# Altium schematic sheet CPU_IO_Ports.SchDoc
size A4
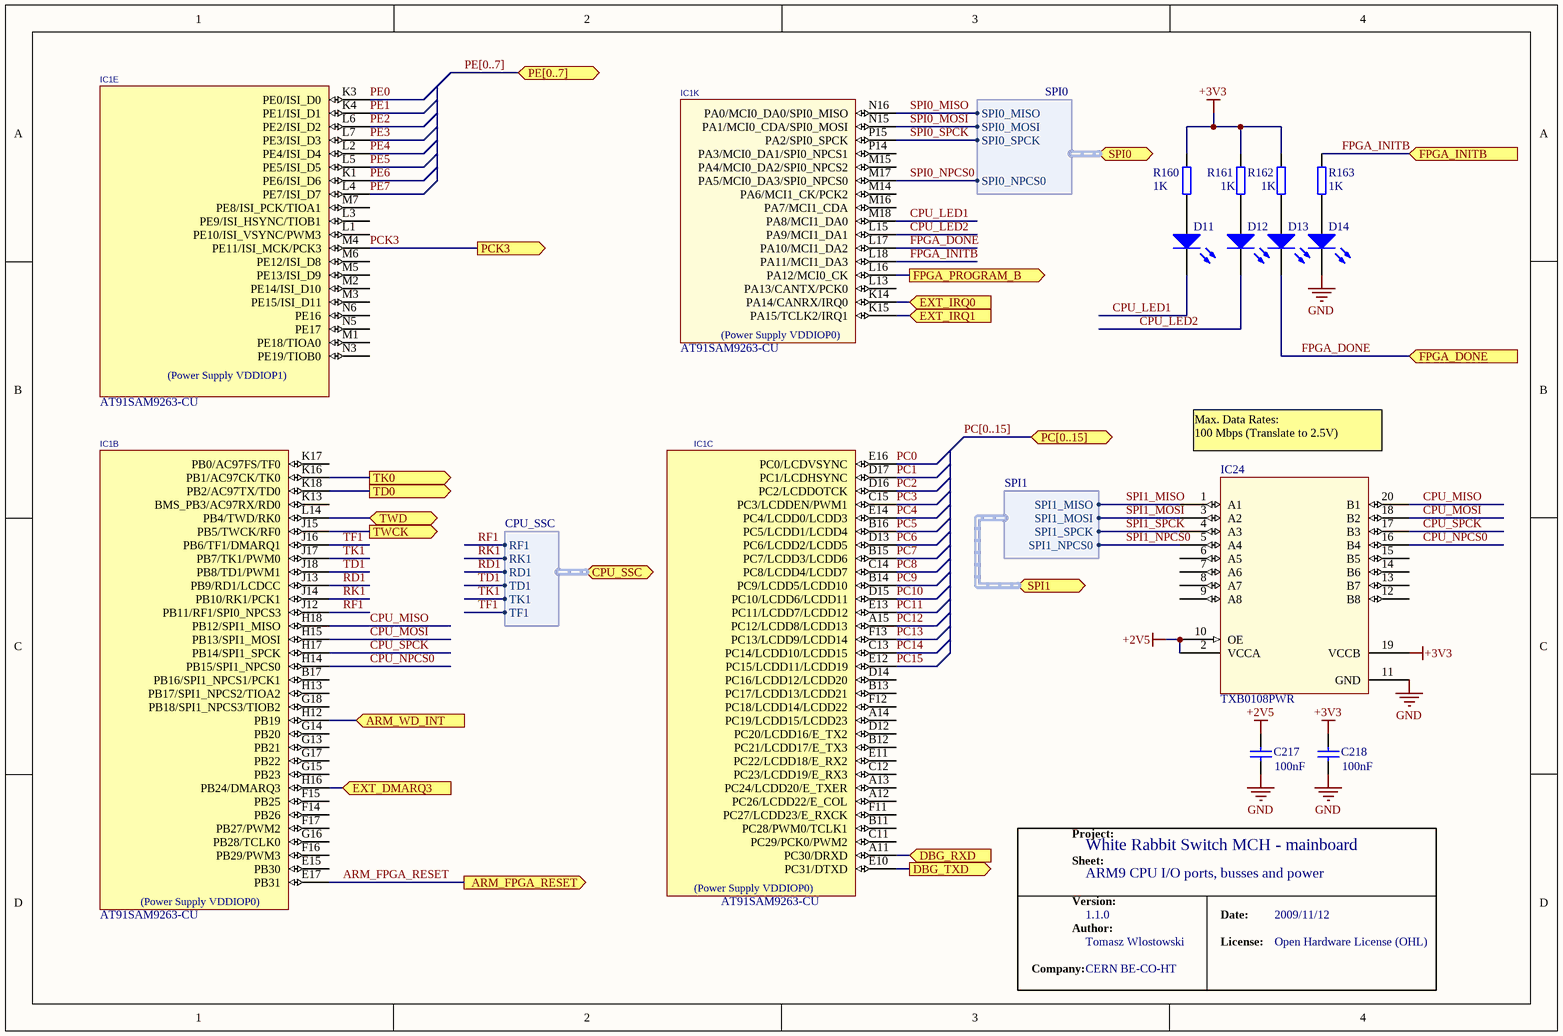
[diagram p0: CPU_IO_Ports.SchDoc]

## Parts
C217  100nF  [CC1005-0402]
C218  100nF  [CC1005-0402]
D11  LED  [CD1608-0603]  (value not drawn)
D12  LED  [CD1608-0603]  (value not drawn)
D13  LED  [CD1608-0603]  (value not drawn)
D14  LED  [CD1608-0603]  (value not drawn)
IC1  AT91SAM9263-CU  [TFBGA324]  (parts B,C,E,K of 12)
IC24  TXB0108PWR  [TSSOP20]
R160  1K  [0402]
R161  1K  [0402]
R162  1K  [0402]
R163  1K  [0402]

## Ports
ARM_FPGA_RESET (out), ARM_WD_INT (in), CPU_SSC (harness CPU_SSC), DBG_RXD (in), DBG_TXD (out), EXT_DMARQ3 (in), EXT_IRQ0 (in), EXT_IRQ1 (in), FPGA_DONE (in), FPGA_INITB (in), FPGA_PROGRAM_B (out), PC[0..15] (bidir), PCK3 (out), PE[0..7] (bidir), SPI0 (harness SPI0), SPI1 (harness SPI1), TD0 (out), TK0 (out), TWCK (out), TWD (bidir)

## Harnesses
CPU_SSC: TF1, TK1, TD1, RD1, RK1, RF1
SPI0: SPI0_MISO, SPI0_MOSI, SPI0_SPCK, SPI0_NPCS0
SPI1: SPI1_MISO, SPI1_MOSI, SPI1_SPCK, SPI1_NPCS0

## Nets
+2V5: C217.2 IC24.2(VCCA) IC24.10(OE)
+3V3: C218.2 IC24.19(VCCB) R160.1 R161.1 R162.1
GND: C217.1 C218.1 D14.2(K) IC24.11(GND)
ARM_FPGA_RESET: IC1.E17(PB31) ; port ARM_FPGA_RESET
ARM_WD_INT: IC1.H12(PB19) ; port ARM_WD_INT
CPU_LED1: D11.2(K) IC1.M18(PA8/MCI1_DA0)
CPU_LED2: D12.2(K) IC1.L15(PA9/MCI1_DA1)
CPU_MISO: IC1.H18(PB12/SPI1_MISO) IC24.20(B1)
CPU_MOSI: IC1.H15(PB13/SPI1_MOSI) IC24.18(B2)
CPU_NPCS0: IC1.H14(PB15/SPI1_NPCS0) IC24.16(B4)
CPU_SPCK: IC1.H17(PB14/SPI1_SPCK) IC24.17(B3)
DBG_RXD: IC1.A11(PC30/DRXD) ; port DBG_RXD
DBG_TXD: IC1.E10(PC31/DTXD) ; port DBG_TXD
EXT_DMARQ3: IC1.H16(PB24/DMARQ3) ; port EXT_DMARQ3
EXT_IRQ0: IC1.K14(PA14/CANRX/IRQ0) ; port EXT_IRQ0
EXT_IRQ1: IC1.K15(PA15/TCLK2/IRQ1) ; port EXT_IRQ1
FPGA_DONE: D13.2(K) IC1.L17(PA10/MCI1_DA2) ; port FPGA_DONE
FPGA_INITB: IC1.L18(PA11/MCI1_DA3) R163.1 ; port FPGA_INITB
FPGA_PROGRAM_B: IC1.L16(PA12/MCI0_CK) ; port FPGA_PROGRAM_B
PC0: IC1.E16(PC0/LCDVSYNC)
PC1: IC1.D17(PC1/LCDHSYNC)
PC2: IC1.D16(PC2/LCDDOTCK)
PC3: IC1.C15(PC3/LCDDEN/PWM1)
PC4: IC1.E14(PC4/LCDD0/LCDD3)
PC5: IC1.B16(PC5/LCDD1/LCDD4)
PC6: IC1.D13(PC6/LCDD2/LCDD5)
PC7: IC1.B15(PC7/LCDD3/LCDD6)
PC8: IC1.C14(PC8/LCDD4/LCDD7)
PC9: IC1.B14(PC9/LCDD5/LCDD10)
PC10: IC1.D15(PC10/LCDD6/LCDD11)
PC11: IC1.E13(PC11/LCDD7/LCDD12)
PC12: IC1.A15(PC12/LCDD8/LCDD13)
PC13: IC1.F13(PC13/LCDD9/LCDD14)
PC14: IC1.C13(PC14/LCDD10/LCDD15)
PC15: IC1.E12(PC15/LCDD11/LCDD19)
PCK3: IC1.M4(PE11/ISI_MCK/PCK3) ; port PCK3
PE0: IC1.K3(PE0/ISI_D0)
PE1: IC1.K4(PE1/ISI_D1)
PE2: IC1.L6(PE2/ISI_D2)
PE3: IC1.L7(PE3/ISI_D3)
PE4: IC1.L2(PE4/ISI_D4)
PE5: IC1.L5(PE5/ISI_D5)
PE6: IC1.K1(PE6/ISI_D6)
PE7: IC1.L4(PE7/ISI_D7)
RD1: IC1.J13(PB9/RD1/LCDCC) ; port CPU_SSC.RD1
RF1: IC1.J12(PB11/RF1/SPI0_NPCS3) ; port CPU_SSC.RF1
RK1: IC1.J14(PB10/RK1/PCK1) ; port CPU_SSC.RK1
SPI0_MISO: IC1.N16(PA0/MCI0_DA0/SPI0_MISO) ; port SPI0.SPI0_MISO
SPI0_MOSI: IC1.N15(PA1/MCI0_CDA/SPI0_MOSI) ; port SPI0.SPI0_MOSI
SPI0_NPCS0: IC1.M17(PA5/MCI0_DA3/SPI0_NPCS0) ; port SPI0.SPI0_NPCS0
SPI0_SPCK: IC1.P15(PA2/SPI0_SPCK) ; port SPI0.SPI0_SPCK
SPI1_MISO: IC24.1(A1) ; port SPI1.SPI1_MISO
SPI1_MOSI: IC24.3(A2) ; port SPI1.SPI1_MOSI
SPI1_NPCS0: IC24.5(A4) ; port SPI1.SPI1_NPCS0
SPI1_SPCK: IC24.4(A3) ; port SPI1.SPI1_SPCK
TD0: IC1.K18(PB2/AC97TX/TD0) ; port TD0
TD1: IC1.J18(PB8/TD1/PWM1) ; port CPU_SSC.TD1
TF1: IC1.J16(PB6/TF1/DMARQ1) ; port CPU_SSC.TF1
TK0: IC1.K16(PB1/AC97CK/TK0) ; port TK0
TK1: IC1.J17(PB7/TK1/PWM0) ; port CPU_SSC.TK1
TWCK: IC1.J15(PB5/TWCK/RF0) ; port TWCK
TWD: IC1.L14(PB4/TWD/RK0) ; port TWD
NetD11_1: D11.1(A) R160.2
NetD12_1: D12.1(A) R161.2
NetD13_1: D13.1(A) R162.2
NetD14_1: D14.1(A) R163.2

Not connected (* = marked no-connect by the designer): IC1 A12(PC26/LCDD22/E_COL) A13(PC24/LCDD20/E_TXER) A14(PC19/LCDD15/LCDD23) B11(PC28/PWM0/TCLK1) B12(PC21/LCDD17/E_TX3) B13(PC17/LCDD13/LCDD21) B17(PB16/SPI1_NPCS1/PCK1) C11(PC29/PCK0/PWM2) C12(PC23/LCDD19/E_RX3) D12(PC20/LCDD16/E_TX2) D14(PC16/LCDD12/LCDD20) E11(PC22/LCDD18/E_RX2) E15(PB30) F11(PC27/LCDD23/E_RXCK) F12(PC18/LCDD14/LCDD22) F14(PB26) F15(PB25) F16(PB29/PWM3) F17(PB27/PWM2) G13(PB21) G14(PB20) G15(PB23) G16(PB28/TCLK0) G17(PB22) G18(PB18/SPI1_NPCS3/TIOB2) H13(PB17/SPI1_NPCS2/TIOA2) K13(BMS_PB3/AC97RX/RD0) K17(PB0/AC97FS/TF0) L1(PE10/ISI_VSYNC/PWM3) L3(PE9/ISI_HSYNC/TIOB1) L13(PA13/CANTX/PCK0) M1(PE18/TIOA0) M2(PE14/ISI_D10) M3(PE15/ISI_D11) M5(PE13/ISI_D9) M6(PE12/ISI_D8) M7(PE8/ISI_PCK/TIOA1) M14(PA6/MCI1_CK/PCK2) M15(PA4/MCI0_DA2/SPI0_NPCS2) M16(PA7/MCI1_CDA) N3(PE19/TIOB0) N5(PE17) N6(PE16) P14(PA3/MCI0_DA1/SPI0_NPCS1); IC24 6(A5) 7(A6) 8(A7) 9(A8) 12(B8) 13(B7) 14(B6) 15(B5)

## Buses and harness runs
bus PC[0..15] = port PC[0..15]
bus PE[0..7] = port PE[0..7]

## Notes on the sheet
- Max. Data Rates:
  100 Mbps (Translate to 2.5V)
- Project:
- White Rabbit Switch MCH - mainboard
- Sheet:
- Version:
- ARM9 CPU I/O ports, busses and power
- 1.1.0
- Date:
- 2009/11/12
- Company:
- Author:
- Tomasz Wlostowski
- CERN BE-CO-HT
- License:
- Open Hardware License (OHL)
- (in symbol AT91SAM9263, part B) (Power Supply VDDIOP0)
- (in symbol AT91SAM9263, part C) (Power Supply VDDIOP0)
- (in symbol AT91SAM9263, part E) (Power Supply VDDIOP1)
- (in symbol AT91SAM9263, part K) (Power Supply VDDIOP0)

## Library data of the parts
C217 C218 = CC0402_100NF_16V_10%_X7R: Capacitor; Manufacturer1: TDK; Manufacturer1 PN: C1005X7R1C104K; TC: X7R; Tolerance: ±10%; Voltage: 16V; Published: 8-Jun-2000; LatestRevisionDate: 17-Jul-2002; LatestRevisionNote: Re-released for DXP Platform.; PackageReference: RAD-0.3; Publisher: Altium Limited; Distributor1: Digikey; Distributor1 PN: 445-4952-1-ND; Case: 0402; Value: 100nF
D11-D14 = LED0: Typical INFRARED GaAs LED; Value: LG L29K-G2J1-24-Z; Published: 8-Jun-2000; LatestRevisionDate: 08-Jul-2005; LatestRevisionNote: Mech Layer 1 removed.; PackageReference: LED-0; Publisher: Altium Limited; Distributor1: Digikey; Distributor1 PN: 475-2709-1-ND
IC1 = AT91SAM9263: Atmel ARM926 MCU; Supplier: EBV; RefId: AT91SAM9263-CU; Value: AT91SAM9263-CU
IC24 = TXB0108: 8-Bit Bidirectional Voltage-Level Translator with Auto-Direction Sensing; Value: TXB0108PWR; Distributor1: Digikey; Distributor1 PN: 296-21527-1-ND
R160-R163 = R0402_1K_±1%_0.1W_100PPM: SMD Resistor; Manufacturer1: Panasonic; Manufacturer1 PN: ERJ-2RKF1001X; TCR: 100ppm; Power Rating: 0.1W; Tolerance: ±1%; Case: 0402; Distributor1: DigiKey; Distributor1 PN: P1.00KLCT-ND; Value: 1K